# Altium schematic sheet interface.SchDoc
size A4
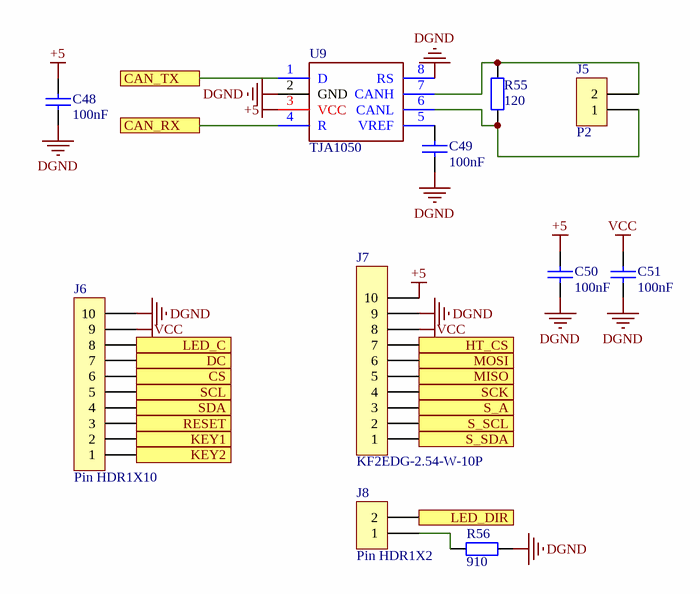
[diagram p0: interface.SchDoc]

## Parts
C48  value 100nF  [C 0402_L]  (hidden comment: Cap)
C49  value 100nF  [C 0402_L]  (hidden comment: Cap)
C50  value 100nF  [C 0402_L]  (hidden comment: Cap)
C51  value 100nF  [C 0402_L]  (hidden comment: Cap)
J5  P2  [KF2EDGK-2.54W-2P]
J6  Pin HDR1X10  [FPC0.5 2H-WS-10P]
J7  KF2EDG-2.54-W-10P  [KF2EDGK-2.54W-10P]
J8  Pin HDR1X2  [Pin HDR1X2/2.54mm-S]
R55  value 120  [0402R]  (hidden comment: Res1)
R56  value 910  [0402R]  (hidden comment: Res1)
U9  TJA1050  [SOP8_M]

## Ports
CAN_RX, CAN_TX, CS, DC, HT_CS, KEY1, KEY2, LED_C, LED_DIR, MISO, MOSI, RESET, S_A, S_SCL, S_SDA, SCK, SCL, SDA

## Nets
+5: C48.2 C50.2 J7.10 U9.3(VCC)
DGND: C48.1 C49.1 C50.1 C51.1 J6.10 J7.9 R56.2 U9.2(GND) U9.8(RS)
VCC: C51.2 J6.9 J7.8
CAN_RX: U9.4(R) ; port CAN_RX
CAN_TX: U9.1(D) ; port CAN_TX
CS: J6.6 ; port CS
DC: J6.7 ; port DC
HT_CS: J7.7 ; port HT_CS
KEY1: J6.2 ; port KEY1
KEY2: J6.1 ; port KEY2
LED_C: J6.8 ; port LED_C
LED_DIR: J8.2 ; port LED_DIR
MISO: J7.5 ; port MISO
MOSI: J7.6 ; port MOSI
RESET: J6.3 ; port RESET
S_A: J7.3 ; port S_A
S_SCL: J7.2 ; port S_SCL
S_SDA: J7.1 ; port S_SDA
SCK: J7.4 ; port SCK
SCL: J6.5 ; port SCL
SDA: J6.4 ; port SDA
NetC49_2: C49.2 U9.5(VREF)
NetJ5_1: J5.1 R55.1 U9.6(CANL)
NetJ5_2: J5.2 R55.2 U9.7(CANH)
NetJ8_1: J8.1 R56.1

## Library data of the parts
C48-C51 = C0402: 无极性电容; Published: 8-Jun-2000; LatestRevisionDate: 17-Jul-2002; LatestRevisionNote: Re-released for DXP Platform.; PackageReference: RAD-0.3; Publisher: Altium Limited
J5 = KF2EDG-2.54-W-2P: 弯针
R55 R56 = R0402: 贴片电阻; Published: 8-Jun-2000; LatestRevisionDate: 17-Jul-2002; LatestRevisionNote: Re-released for DXP Platform.; PackageReference: AXIAL-0.4; Publisher: Altium Limited
U9 = SN65HVD230DR